# Altium schematic sheet dcdc.schdoc
size A3
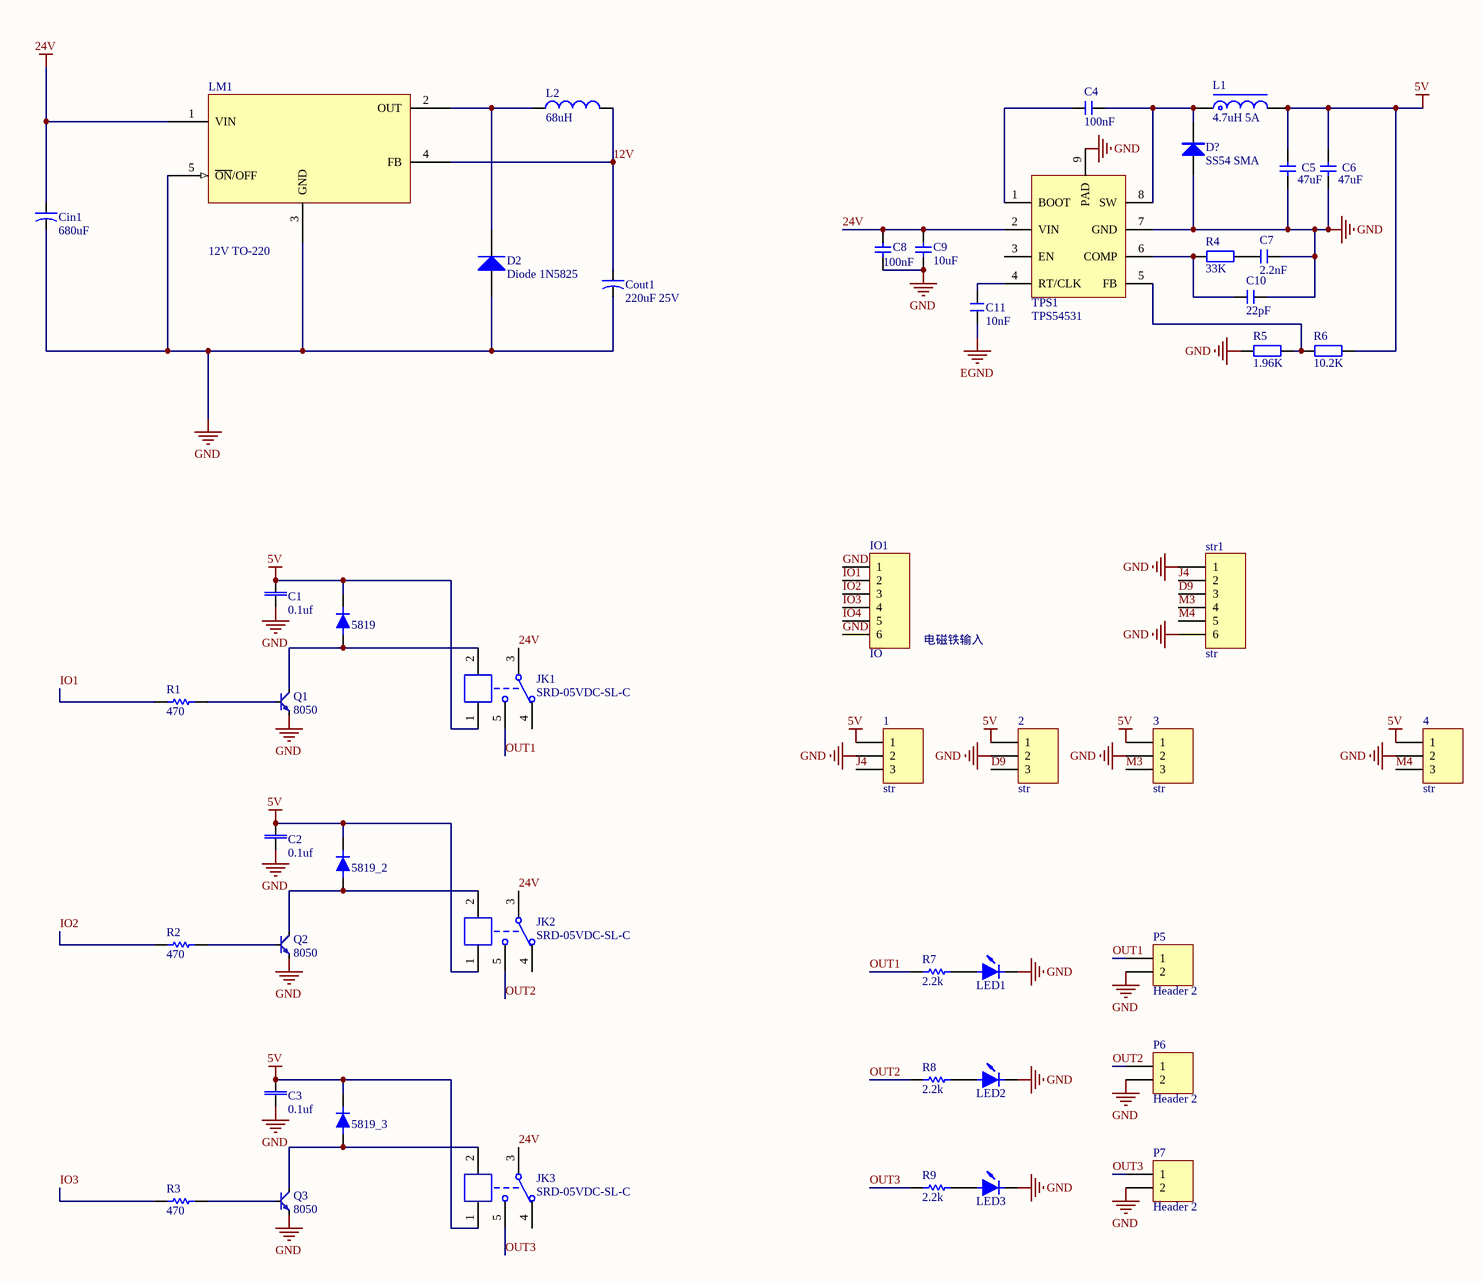
[diagram p0: dcdc.schdoc]

## Parts
1  str  [XH2.54-3P_H]
2  str  [XH2.54-3P_H]
3  str  [XH2.54-3P_H]
4  str  [XH2.54-3P_H]
5819  SS14  [SS14]  (value not drawn)
5819_2  SS14  [SS14]  (value not drawn)
5819_3  SS14  [SS14]  (value not drawn)
C1  0.1uf  [C 0805]
C2  0.1uf  [C 0805]
C3  0.1uf  [C 0805]
C4  100nF  [C 0805]
C5  47uF  [C 0805]
C6  47uF  [C 0805]
C7  2.2nF  [C 0805]
C8  100nF  [C 0805]
C9  10uF  [C 0805]
C10  22pF  [C 0805]
C11  10nF  [C 0805]
Cin1  680uF  [capacitor]
Cout1  220uF 25V  [capacitor]
D2  Diode 1N5825  [DO-201AD]
D?  SS54 SMA  [SS14]
IO1  IO  [XH2.54-6P_H]
JK1  SRD-05VDC-SL-C  [SRD-C_B]
JK2  SRD-05VDC-SL-C  [SRD-C_B]
JK3  SRD-05VDC-SL-C  [SRD-C_B]
L1  4.7uH 5A  [CDRH74]
L2  68uH  [CDRH74]
LED1  LED0805  [D0805]  (value not drawn)
LED2  LED0805  [D0805]  (value not drawn)
LED3  LED0805  [D0805]  (value not drawn)
LM1  12V TO-220  [LM2596S]
P5  Header 2  [CON2]
P6  Header 2  [CON2]
P7  Header 2  [CON2]
Q1  8050  [SOT23-3]
Q2  8050  [SOT23-3]
Q3  8050  [SOT23-3]
R1  470  [R 0805]
R2  470  [R 0805]
R3  470  [R 0805]
R4  33K  [R 0805]
R5  1.96K  [R 0805]
R6  10.2K  [R 0805]
R7  2.2k  [R 0805]
R8  2.2k  [R 0805]
R9  2.2k  [R 0805]
str1  str  [XH2.54-6P_H]
TPS1  TPS54531  [TPS54560]

## Nets
5V: 1.1 2.1 3.1 4.1 5819.2(K) 5819_2.2(K) 5819_3.2(K) C1.1 C2.1 C3.1 C5.2 C6.2 JK1.1 JK2.1 JK3.1 L1.2 R6.2
24V: C8.2 C9.2 Cin1.1 JK1.3 JK2.3 JK3.3 LM1.1(VIN) TPS1.2(VIN)
EGND: C11.1
GND: 1.2 2.2 3.2 4.2 C1.2 C2.2 C3.2 C5.1 C6.1 C7.2 C8.1 C9.1 C10.2 Cin1.2 Cout1.2 D2.1(A) D?.1(A) IO1.1 IO1.6 LED1.2(K) LED2.2(K) LED3.2(K) LM1.3(GND) LM1.5(~{ON}/OFF) P5.2 P6.2 P7.2 Q1.2(E) Q2.2(E) Q3.2(E) R5.1 str1.1 str1.6 TPS1.7(GND) TPS1.9(PAD)
12V: Cout1.1 L2.2 LM1.4(FB)
D9: 2.3 str1.3
IO1: IO1.2 R1.1
IO2: IO1.3 R2.1
IO3: IO1.4 R3.1
IO4: IO1.5
J4: 1.3 str1.2
M3: 3.3 str1.4
M4: 4.3 str1.5
OUT1: JK1.5 P5.1 R7.2
OUT2: JK2.5 P6.1 R8.2
OUT3: JK3.5 P7.1 R9.2
Net5819_1: 5819.1(A) JK1.2 Q1.3(C)
Net5819_2_1: 5819_2.1(A) JK2.2 Q2.3(C)
Net5819_3_1: 5819_3.1(A) JK3.2 Q3.3(C)
NetC4_1: C4.1 D?.2(K) L1.1 TPS1.8(SW)
NetC4_2: C4.2 TPS1.1(BOOT)
NetC7_1: C7.1 R4.2
NetC10_1: C10.1 R4.1 TPS1.6(COMP)
NetC11_2: C11.2 TPS1.4(RT/CLK)
NetD2_2: D2.2(K) L2.1 LM1.2(OUT)
NetLED1_1: LED1.1(A) R7.1
NetLED2_1: LED2.1(A) R8.1
NetLED3_1: LED3.1(A) R9.1
NetQ1_1: Q1.1(B) R1.2
NetQ2_1: Q2.1(B) R2.2
NetQ3_1: Q3.1(B) R3.2
NetR5_2: R5.2 R6.1 TPS1.5(FB)

Not connected (* = marked no-connect by the designer): JK1 4; JK2 4; JK3 4; TPS1 3(EN)

## Notes on the sheet
- 电磁铁输入

## Library data of the parts
1-4 = Header 3: Header, 3-Pin; LatestRevisionDate: 17-Jul-2002; LatestRevisionNote: Re-released for DXP Platform.; Publisher: Altium Limited
C1-C3 = Cap0805
C4 C7 C10 C11 = CAP0603
C5 C6 C8 C9 = CAP_1206
Cin1 Cout1 = Cap2: 脚间距为5mm电容; Published: 23-Sep-2002; PackageReference: CAPR5-4X5; Publisher: Altium Limited
D2 = Diode 1N5406: 是1N5825，不是1N5406; Published: 8-Jun-2000; LatestRevisionDate: 17-Jul-2002; LatestRevisionNote: Re-released for DXP Platform.; DatasheetVersion: 1998; PackageVersion: Aug-1999; PackageReference: DO-201AD; Publisher: Altium Limited; PackageDescription: Diode, Axial; Body 9.5 x 5.6 mm (LxDia. max), Lead Dia. 1.32 mm (max); ComponentLink1Description: Manufacturer Link; ComponentLink1URL: http://www.fairchildsemi.com/; ComponentLink2Description: Datasheet; ComponentLink2URL: http://www.fairchildsemi.com/ds/1N%2F1N5400.pdf
D? = SS14: 肖特基二极管
IO1 str1 = MHDR1X6: Header, 6-Pin; LatestRevisionDate: 17-Jul-2002; LatestRevisionNote: Re-released for DXP Platform.; Publisher: Altium Limited
JK1-JK3 = SRD-05VDC-SL-C: 5V单路双控继电器; BOM名称: 5V继电器; 版权归属: 黎明电子style; 学习资源: https://lmdzstyle.taobao.com/
L1 = L-CDRH: 功率屏蔽电感; 版权归属: 黎明电子style; BOM名称: 功率屏蔽电感; 学习资源: https://lmdzstyle.taobao.com/
L2 = Inductor
LM1 = LM2596S
P5-P7 = Header 2: Header, 2-Pin; LatestRevisionDate: 17-Jul-2002; LatestRevisionNote: Re-released for DXP Platform.; Publisher: Altium Limited
Q1-Q3 = BJT_NPN: Transistor; Value: 8050
R1-R3 R7-R9 = Res1: Resistor; Value: 10K; Published: 8-Jun-2000; LatestRevisionDate: 17-Jul-2002; LatestRevisionNote: Re-released for DXP Platform.; PackageReference: AXIAL-0.3; Publisher: Altium Limited
R4-R6 = RES0603
TPS1 = TPS54560